# Altium project potato.PrjPcb
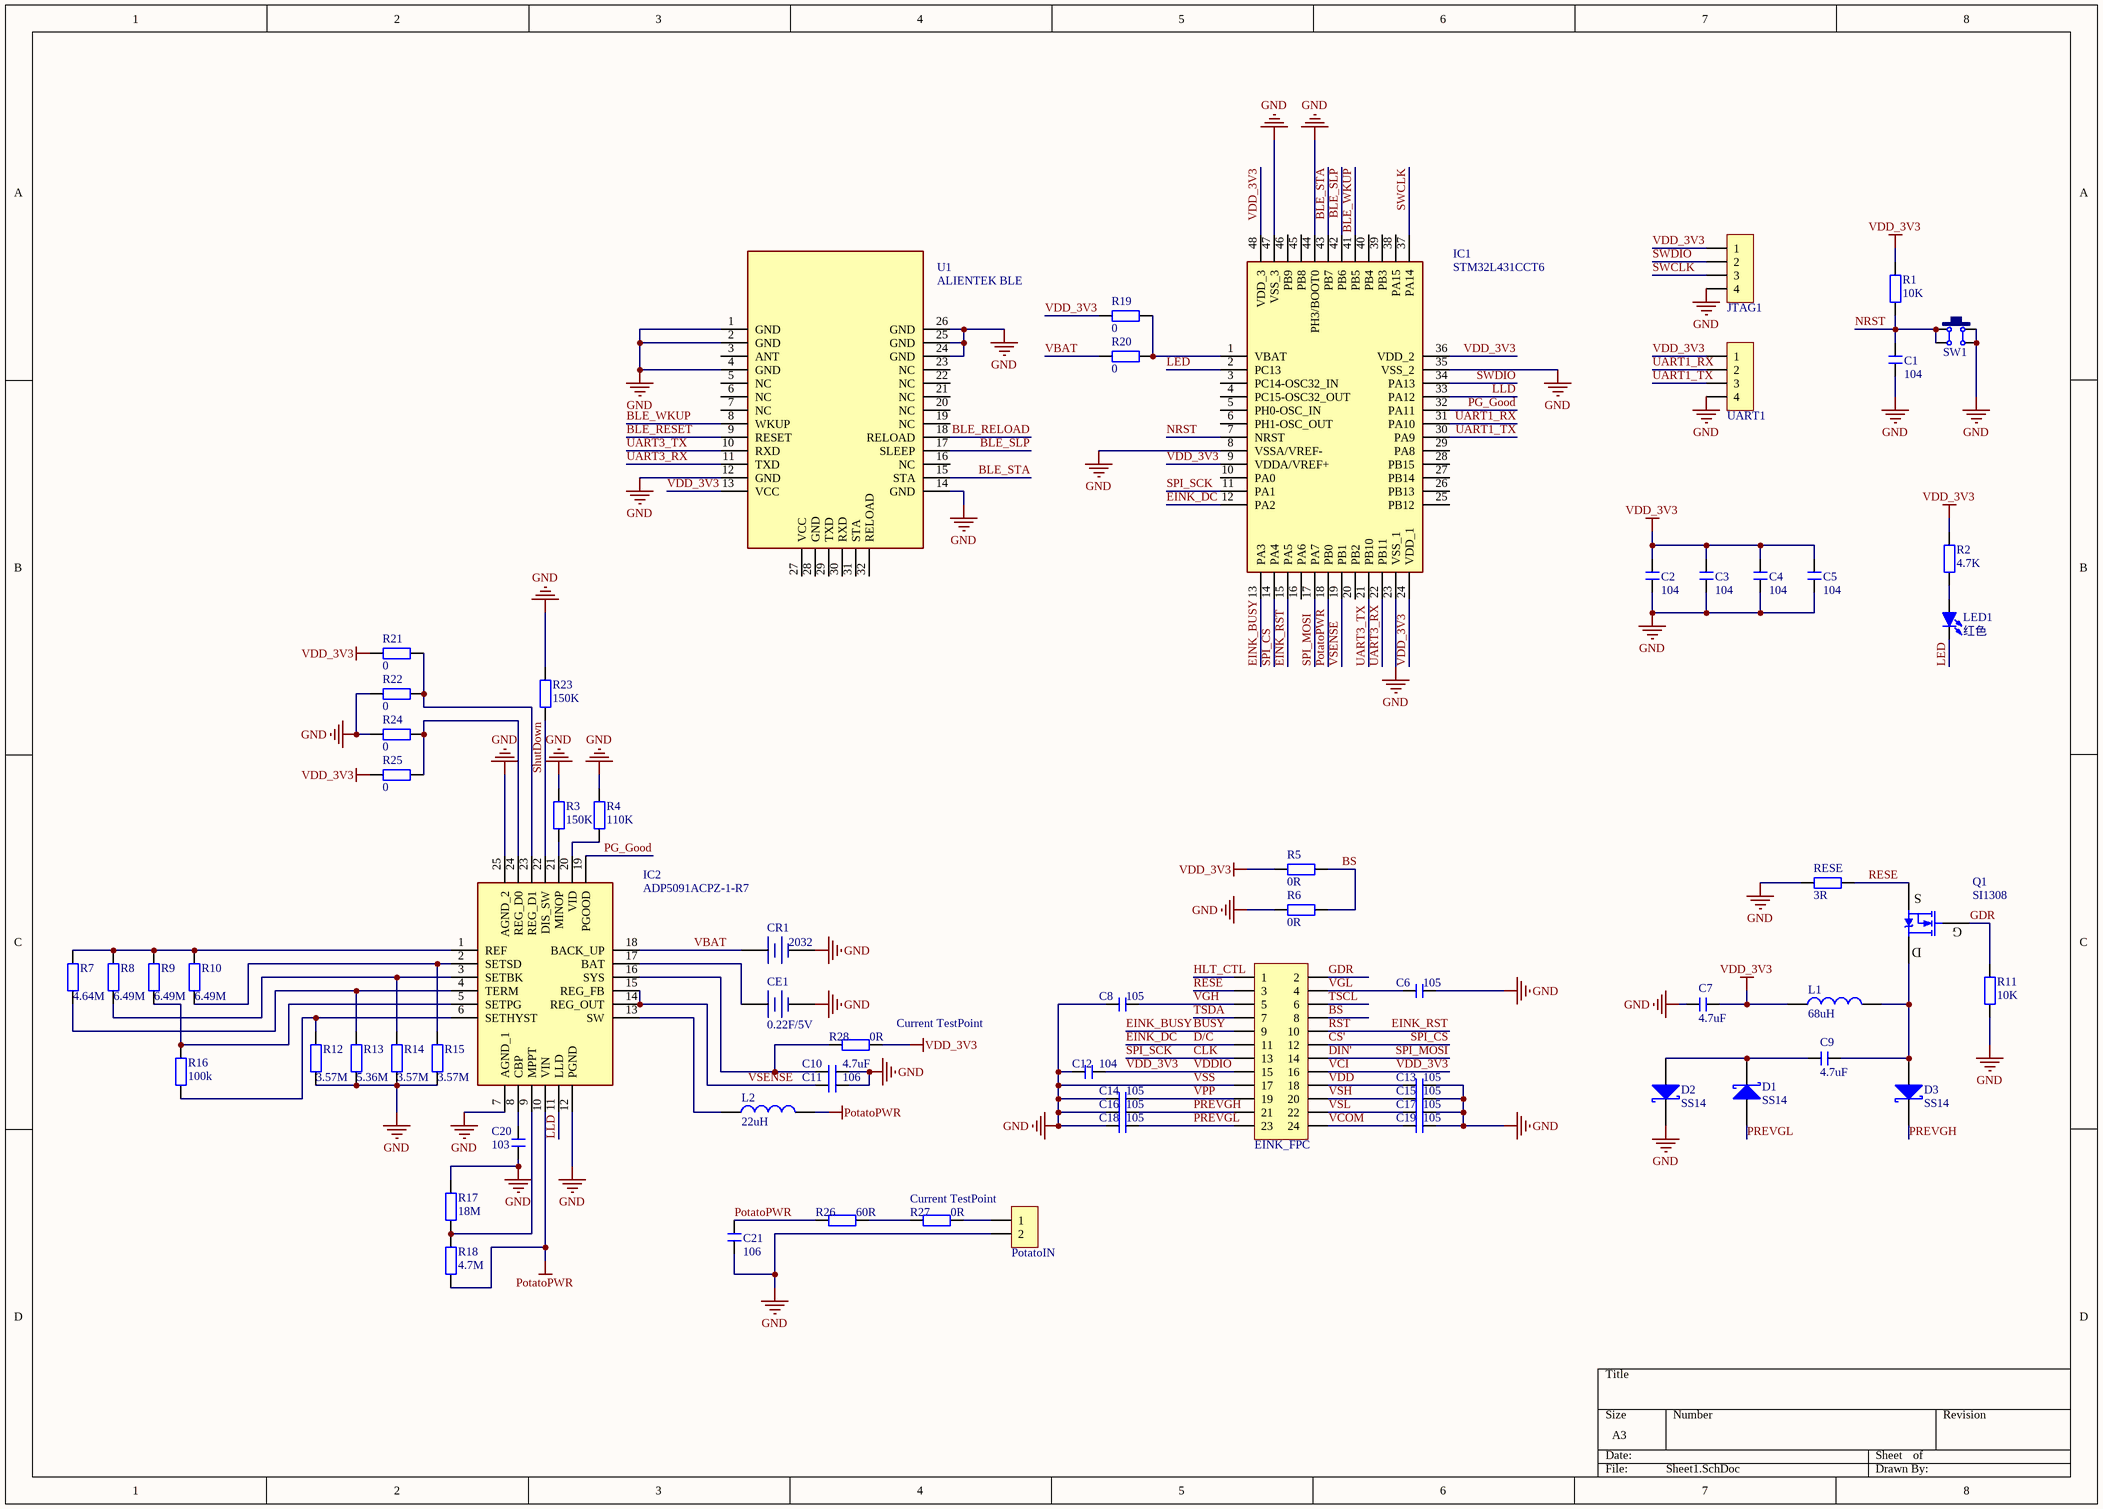
[diagram p0: Sheet1.SchDoc]
1 sheet, 67 parts. Net scope: global (net labels, ports and power ports of the same name join across sheets).
Board file: PCB1.PcbDoc

## Sheet Sheet1.SchDoc
size A3; SheetNumber: 1; SheetTotal: 1

### Parts
C1  104  [C 0603_L]
C2  104  [C 0603_L]
C3  104  [C 0603_L]
C4  104  [C 0603_L]
C5  104  [C 0603_L]
C6  105  [C 0603_L]
C7  4.7uF  [C 0603_L]
C8  105  [C 0603_L]
C9  4.7uF  [C 0603_L]
C10  4.7uF  [C 0603_L]
C11  106  [C 0603_L]
C12  104  [C 0603_L]
C13  105  [C 0603_L]
C14  105  [C 0603_L]
C15  105  [C 0603_L]
C16  105  [C 0603_L]
C17  105  [C 0603_L]
C18  105  [C 0603_L]
C19  105  [C 0603_L]
C20  103  [C 0603_L]
C21  106  [C 0603_L]
CE1  0.22F/5V  [CAP 5.0*12.5*20 - BK]
CR1  2032  [CR2032_A]
D1  SS14  [SOD-123]
D2  SS14  [SOD-123]
D3  SS14  [SOD-123]
EINK_FPC  Header 2X11  [FPC0.5 2H-WS-24P]  (value not drawn)
IC1  STM32L431CCT6  [QFP50P900X900X160-48N]
IC2  ADP5091ACPZ-1-R7  [QFN50P400X400X80-25N-D]
JTAG1  HDR-1X4  [XH2.54-LI-4P]  (value not drawn)
L1  68uH  [CDRH74]
L2  22uH  [CDRH74]
LED1  红色  [LED 0603R]
PotatoIN  HDR-1X2  [XH2.54-LI-2P]  (value not drawn)
Q1  SI1308  [SOT23-3N]
R1  10K  [R 0603_L]
R2  4.7K  [R 0603_L]
R3  150K  [R 0603_L]
R4  110K  [R 0603_L]
R5  0R  [R 0603_L]
R6  0R  [R 0603_L]
R7  4.64M  [R 0603_L]
R8  6.49M  [R 0603_L]
R9  6.49M  [R 0603_L]
R10  6.49M  [R 0603_L]
R11  10K  [R 0603_L]
R12  3.57M  [R 0603_L]
R13  5.36M  [R 0603_L]
R14  3.57M  [R 0603_L]
R15  3.57M  [R 0603_L]
R16  100k  [R 0603_L]
R17  18M  [R 0603_L]
R18  4.7M  [R 0603_L]
R19  0  [R 0603_L]
R20  0  [R 0603_L]
R21  0  [R 0603_L]
R22  0  [R 0603_L]
R23  150K  [R 0603_L]
R24  0  [R 0603_L]
R25  0  [R 0603_L]
R26  60R  [R 0805_L]
R27  0R  [R 1210_L]
R28  0R  [R 1210_L]
RESE  3R  [R 0603_L]
SW1  6x6x5  [TSW SMD-6*6*4.3]  (value not drawn)
U1  ALIENTEK BLE  [ALIENTEK BLE]
UART1  HDR-1X4  [XH2.54-LI-4P]  (value not drawn)

### Nets
PotatoPWR: C21.2 IC1.18(PB0) IC2.10(VIN) L2.2 R18.1 R26.1
VCI: C2.2 C3.2 C4.2 C5.2 C7.2 C12.1 EINK_FPC.15 EINK_FPC.16 IC1.9(VDDA/VREF+) IC1.24(VDD_1) IC1.36(VDD_2) IC1.48(VDD_3) JTAG1.1 L1.1 R1.2 R2.2 R5.1 R19.2 R21.2 R25.2 R28.2 U1.13(VCC) UART1.1  [also labelled VDD_3V3, VDDIO]
VSS: C1.1 C2.1 C3.1 C4.1 C5.1 C6.2 C7.1 C8.1 C10.1 C11.1 C12.2 C13.2 C14.1 C15.2 C16.1 C17.2 C18.1 C19.2 C20.1 C21.1 CE1.2(DC-) CR1.2(DC-) D2.2(K) EINK_FPC.17 IC1.8(VSSA/VREF-) IC1.23(VSS_1) IC1.35(VSS_2) IC1.44(PH3/BOOT0) IC1.47(VSS_3) IC2.7(AGND_1) IC2.12(PGND) IC2.25(AGND_2) JTAG1.4 PotatoIN.2 R3.2 R4.2 R6.1 R11.1 R12.1 R13.1 R14.1 R15.1 R17.2 R22.2 R23.2 R24.2 RESE.2 SW1.2 SW1.3 U1.1(GND) U1.2(GND) U1.4(GND) U1.12(GND) U1.14(GND) U1.24(GND) U1.25(GND) U1.26(GND) UART1.4  [also labelled GND]
BLE_RELOAD: U1.18(RELOAD)
BLE_RESET: U1.9(RESET)
BLE_SLP: IC1.42(PB6) U1.17(SLEEP)
BLE_STA: IC1.43(PB7) U1.15(STA)
BLE_WKUP: IC1.41(PB5) U1.8(WKUP)
BS: EINK_FPC.8 R5.2 R6.2
BUSY: EINK_FPC.9 IC1.13(PA3)  [also labelled EINK_BUSY]
CLK: EINK_FPC.13 IC1.11(PA1)  [also labelled SPI_SCK]
CS': EINK_FPC.12 IC1.14(PA4)  [also labelled SPI_CS]
D/C: EINK_FPC.11 IC1.12(PA2)  [also labelled EINK_DC]
DIN': EINK_FPC.14 IC1.17(PA7)  [also labelled SPI_MOSI]
EINK_RST: EINK_FPC.10 IC1.15(PA5)  [also labelled RST]
GDR: EINK_FPC.2 Q1.1(G) R11.2
HLT_CTL: EINK_FPC.1
LED: IC1.2(PC13) LED1.2(K)
LLD: IC1.33(PA12) IC2.11(LLD)
NRST: C1.2 IC1.7(NRST) R1.1 SW1.1 SW1.4
PG_Good: IC1.32(PA11) IC2.19(PGOOD)
PREVGH: C16.2 D3.2(K) EINK_FPC.21
PREVGL: C18.2 D1.1(A) EINK_FPC.23
RESE: EINK_FPC.3 Q1.2(S) RESE.1
ShutDown: IC2.22(DIS_SW) R23.1
SWCLK: IC1.37(PA14) JTAG1.3
SWDIO: IC1.34(PA13) JTAG1.2
TSCL: EINK_FPC.6
TSDA: EINK_FPC.7
UART1_RX: IC1.31(PA10) UART1.2
UART1_TX: IC1.30(PA9) UART1.3
UART3_RX: IC1.22(PB11) U1.11(TXD)
UART3_TX: IC1.21(PB10) U1.10(RXD)
VBAT: CR1.1(DC+) IC2.18(BACK_UP) R20.2
VCOM: C19.1 EINK_FPC.24
VDD: C13.1 EINK_FPC.18
VGH: C8.2 EINK_FPC.5
VGL: C6.1 EINK_FPC.4
VPP: C14.2 EINK_FPC.19
VSENSE: C11.2 IC1.19(PB1) IC2.14(REG_OUT) IC2.15(REG_FB)
VSH: C15.1 EINK_FPC.20
VSL: C17.1 EINK_FPC.22
NetC9_1: C9.1 D1.2(K) D2.1(A)
NetC9_2: C9.2 D3.1(A) L1.2 Q1.3(D)
NetC10_2: C10.2 IC2.16(SYS) R28.1
NetC20_2: C20.2 IC2.8(CBP)
NetCE1_1: CE1.1(DC+) IC2.17(BAT)
NetIC1_1: IC1.1(VBAT) R19.1 R20.1
NetIC2_1: IC2.1(REF) R7.2 R8.2 R9.2 R10.2
NetIC2_2: IC2.2(SETSD) R10.1 R15.2
NetIC2_3: IC2.3(SETBK) R8.1 R14.2
NetIC2_4: IC2.4(TERM) R7.1 R13.2
NetIC2_5: IC2.5(SETPG) R9.1 R16.2
NetIC2_6: IC2.6(SETHYST) R12.2 R16.1
NetIC2_9: IC2.9(MPPT) R17.1 R18.2
NetIC2_13: IC2.13(SW) L2.1
NetIC2_20: IC2.20(VID) R4.1
NetIC2_21: IC2.21(MINOP) R3.1
NetIC2_23: IC2.23(REG_D1) R21.1 R22.1
NetIC2_24: IC2.24(REG_D0) R24.1 R25.1
NetLED1_1: LED1.1(A) R2.1
NetPotatoIN_1: PotatoIN.1 R27.2
NetR26_2: R26.2 R27.1

Not connected (* = marked no-connect by the designer): IC1 3(PC14-OSC32_IN) 4(PC15-OSC32_OUT) 5(PH0-OSC_IN) 6(PH1-OSC_OUT) 10(PA0) 16(PA6) 20(PB2) 25(PB12) 26(PB13) 27(PB14) 28(PB15) 29(PA8) 38(PA15) 39(PB3) 40(PB4) 45(PB8) 46(PB9); U1 3(ANT) 5(NC) 6(NC) 7(NC) 16(NC) 19(NC) 20(NC) 21(NC) 22(NC) 23(NC) 27(VCC) 28(GND) 29(TXD) 30(RXD) 31(STA) 32(RELOAD)

### Notes on the sheet
- (near R28) Current TestPoint
- Current TestPoint

### Library data of the parts
C1-C21 = C: 贴片电容; BOM名称: 无极性贴片电容; 淘宝ID: 封装库来自淘宝 ID：黄晶宝石; 联系售后，技术支持: https://shop463601444.taobao.com; 唯一出售店铺网址: https://shop463601444.taobao.com
CE1 CR1 = CR-3V: 微型电池; 版权归属: 封装库来自淘宝 ID：黄晶宝石; BOM名称: 微型电池; 学习资源: https://shop463601444.taobao.com
D1-D3 = SS14: 肖特基二极管; 属性: 40V/1A; BOM名称: 肖特基二极管; 封装库来自淘宝 ID：黄晶宝石: https://shop463601444.taobao.com
EINK_FPC = Header 12X2: 12*2P接插件; 版权归属: 封装库来自淘宝卖家 ID：黄晶宝石; BOM名称: 12*2P接插件; 学习资源: https://shop463601444.taobao.com
IC1 = STM32L431CCT6: Integrated Circuit; Manufacturer_Name: STMicroelectronics; Datasheet Link: http://www.st.com/content/ccc/resource/technical/document/datasheet/group3/83/b3/60/f6/b1/cc/47/7e/DM00257211/files/DM00257211.pdf/jcr:content/translations/en.DM00257211.pdf; Height: 1.6mm; Manufacturer_Part_Number: STM32L431CCT6
IC2 = ADP5091ACPZ-1-R7: Integrated Circuit; Manufacturer_Name: Analog Devices; Datasheet Link: http://www.analog.com/media/en/technical-documentation/data-sheets/ADP5091-5092.pdf; Height: 0.8mm; Manufacturer_Part_Number: ADP5091ACPZ-1-R7
JTAG1 UART1 = Header 4: 4P接插件; 联系售后: 封装库来自淘宝 ID：黄晶宝石; BOM名称: 4P接插件; 学习资源: https://shop463601444.taobao.com
L1 L2 = L: 小功率贴片电感; 淘宝ID: 封装库来自淘宝 ID：黄晶宝石; 封装库来自淘宝卖家 ID：黄晶宝石: 其他店铺购入均为盗版，不享受售后技术支持服务，请立即申请退款; BOM名称: 小功率贴片电感; 联系售后: https://shop463601444.taobao.com
LED1 = LED-SMD: 贴片LED; 版权归属: 封装库来自淘宝 ID：黄晶宝石; BOM名称: 贴片LED; 学习资源: https://shop463601444.taobao.com
PotatoIN = Header 2: 2P接插件; 版权归属: 封装库来自淘宝 ID：黄晶宝石; BOM名称: 2P接插件; 联系售后: https://shop463601444.taobao.com
Q1 = SI2302: N沟道场效应管; 技术支持，联系售后: 封装库来自淘宝 ID：黄晶宝石; BOM名称: N沟道场效应管; 学习资源: https://shop463601444.taobao.com
R1-R28 RESE = R: 贴片电阻; 版权归属: 来自淘宝 ID：黄晶宝石; 封装库来自淘宝卖家 ID：黄晶宝石: 其他店铺购入均为盗版，不享受售后技术支持服务，请立即申请退款; BOM名称: 贴片电阻; 联系售后: https://shop463601444.taobao.com
SW1 = TSW SMD-6x6: 贴片6x6轻触开关; 版权归属: 封装库来自淘宝 ID：黄晶宝石; BOM名称: 贴片6x6轻触开关; 唯一出售店铺网址: https://shop463601444.taobao.com